# Altium schematic sheet Mux+Conn.SchDoc
size 558 x 431 mm; SheetNumber: 1; SheetTotal: 1; ENG_APP_DATE: --/--/--; DSN_APP_DATE: --/--/--; CHK_APP_DATE: --/--/--
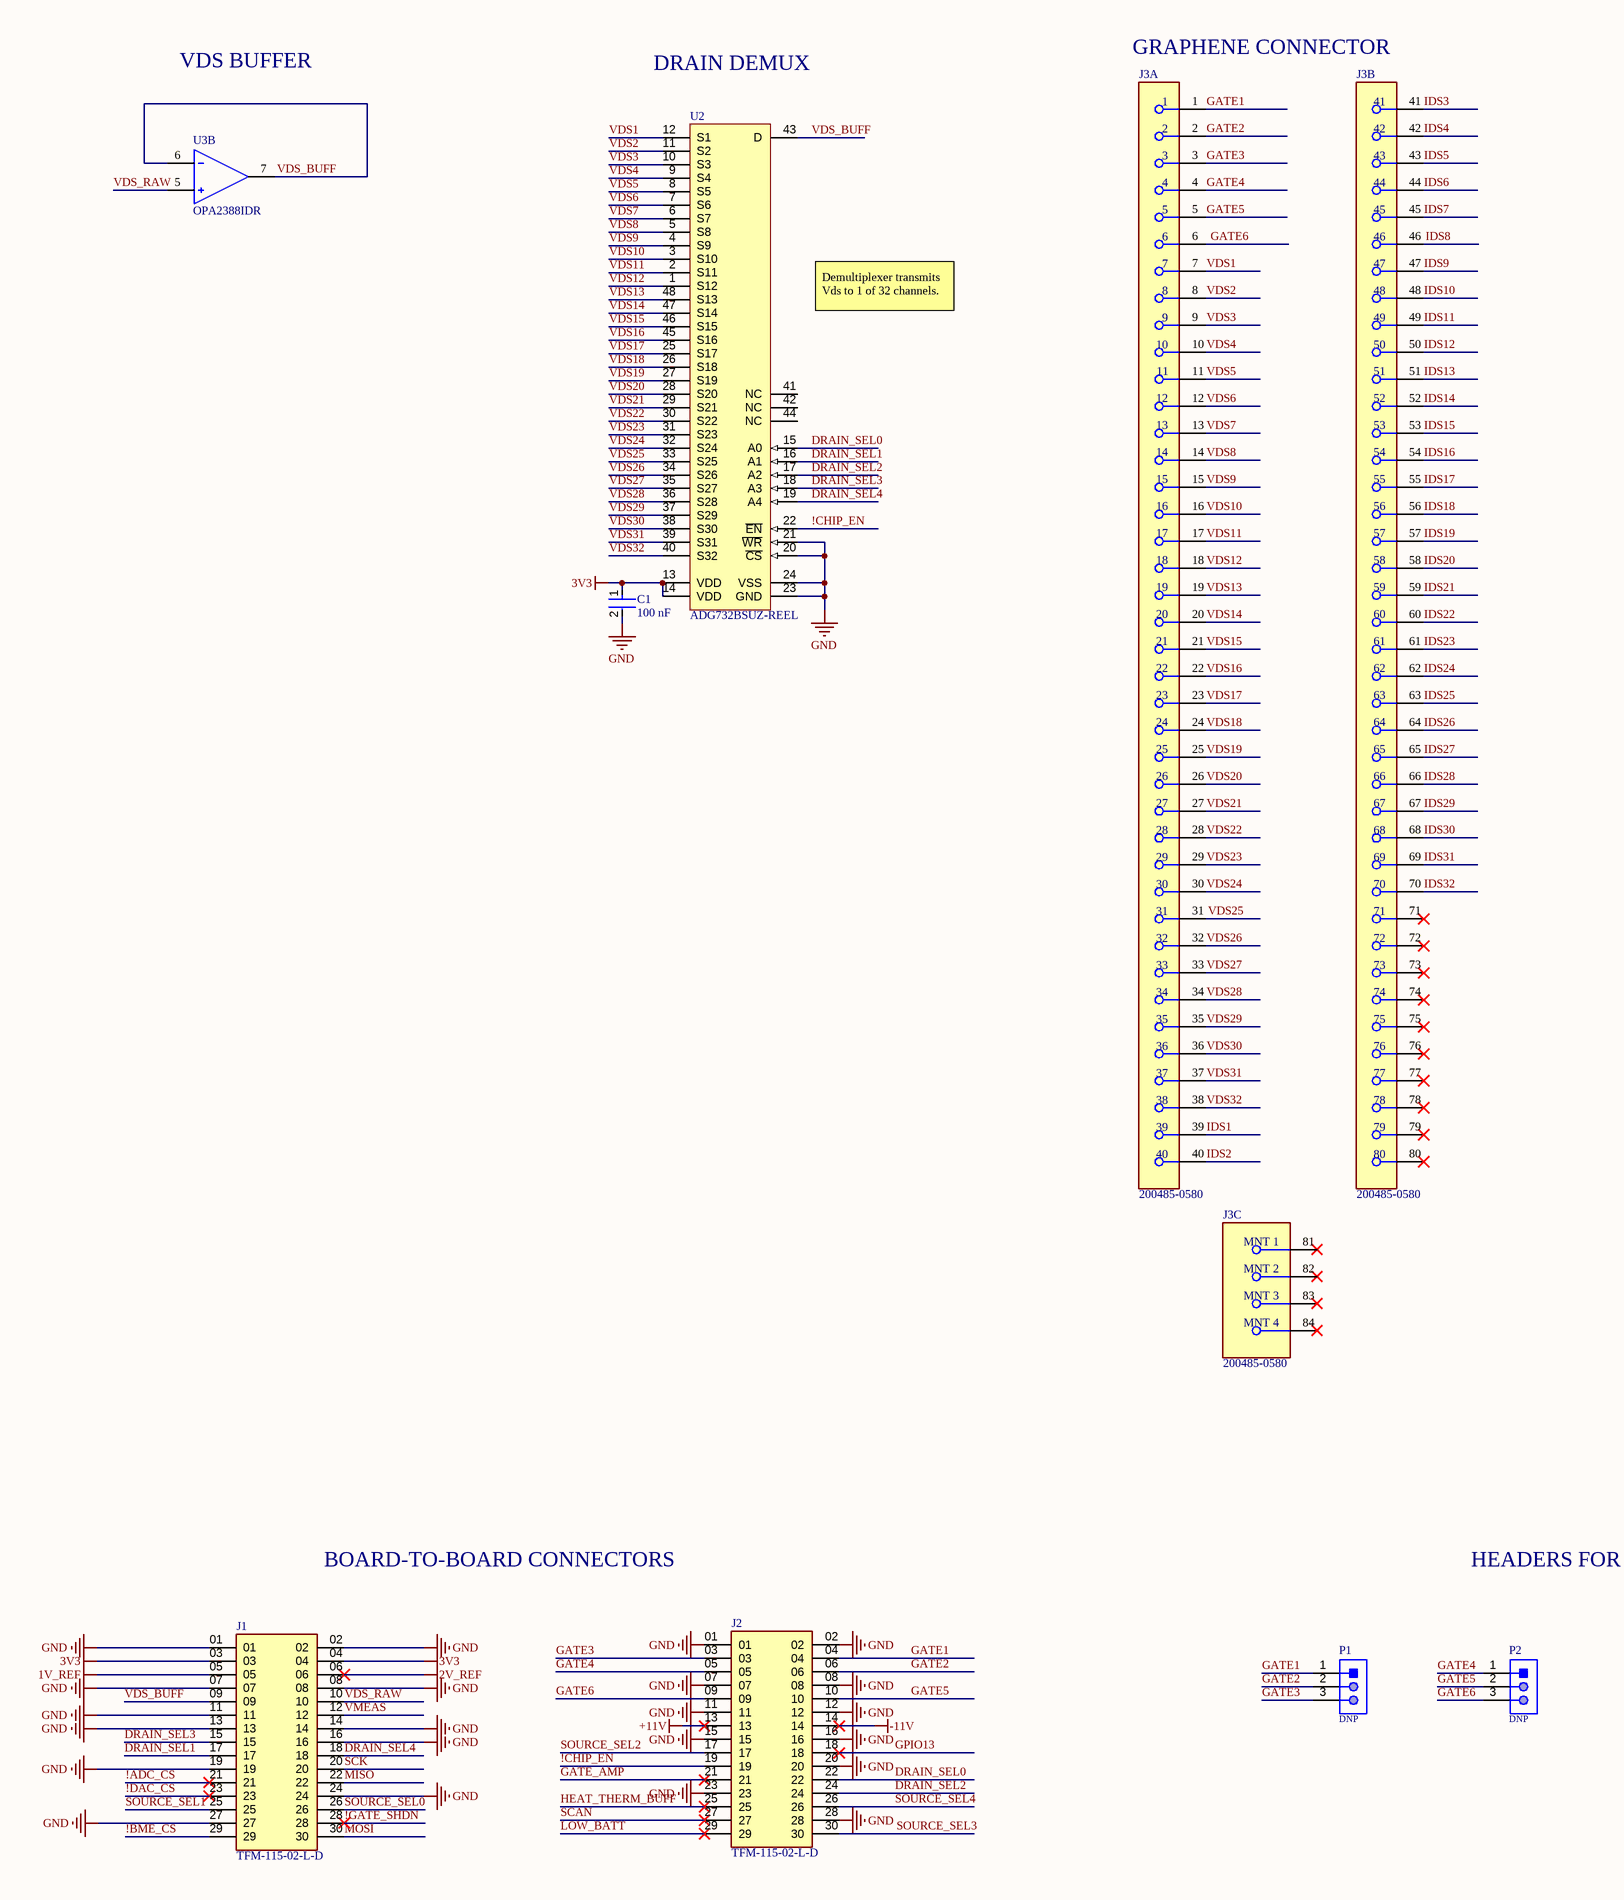
[diagram p0: Mux+Conn.SchDoc, left]
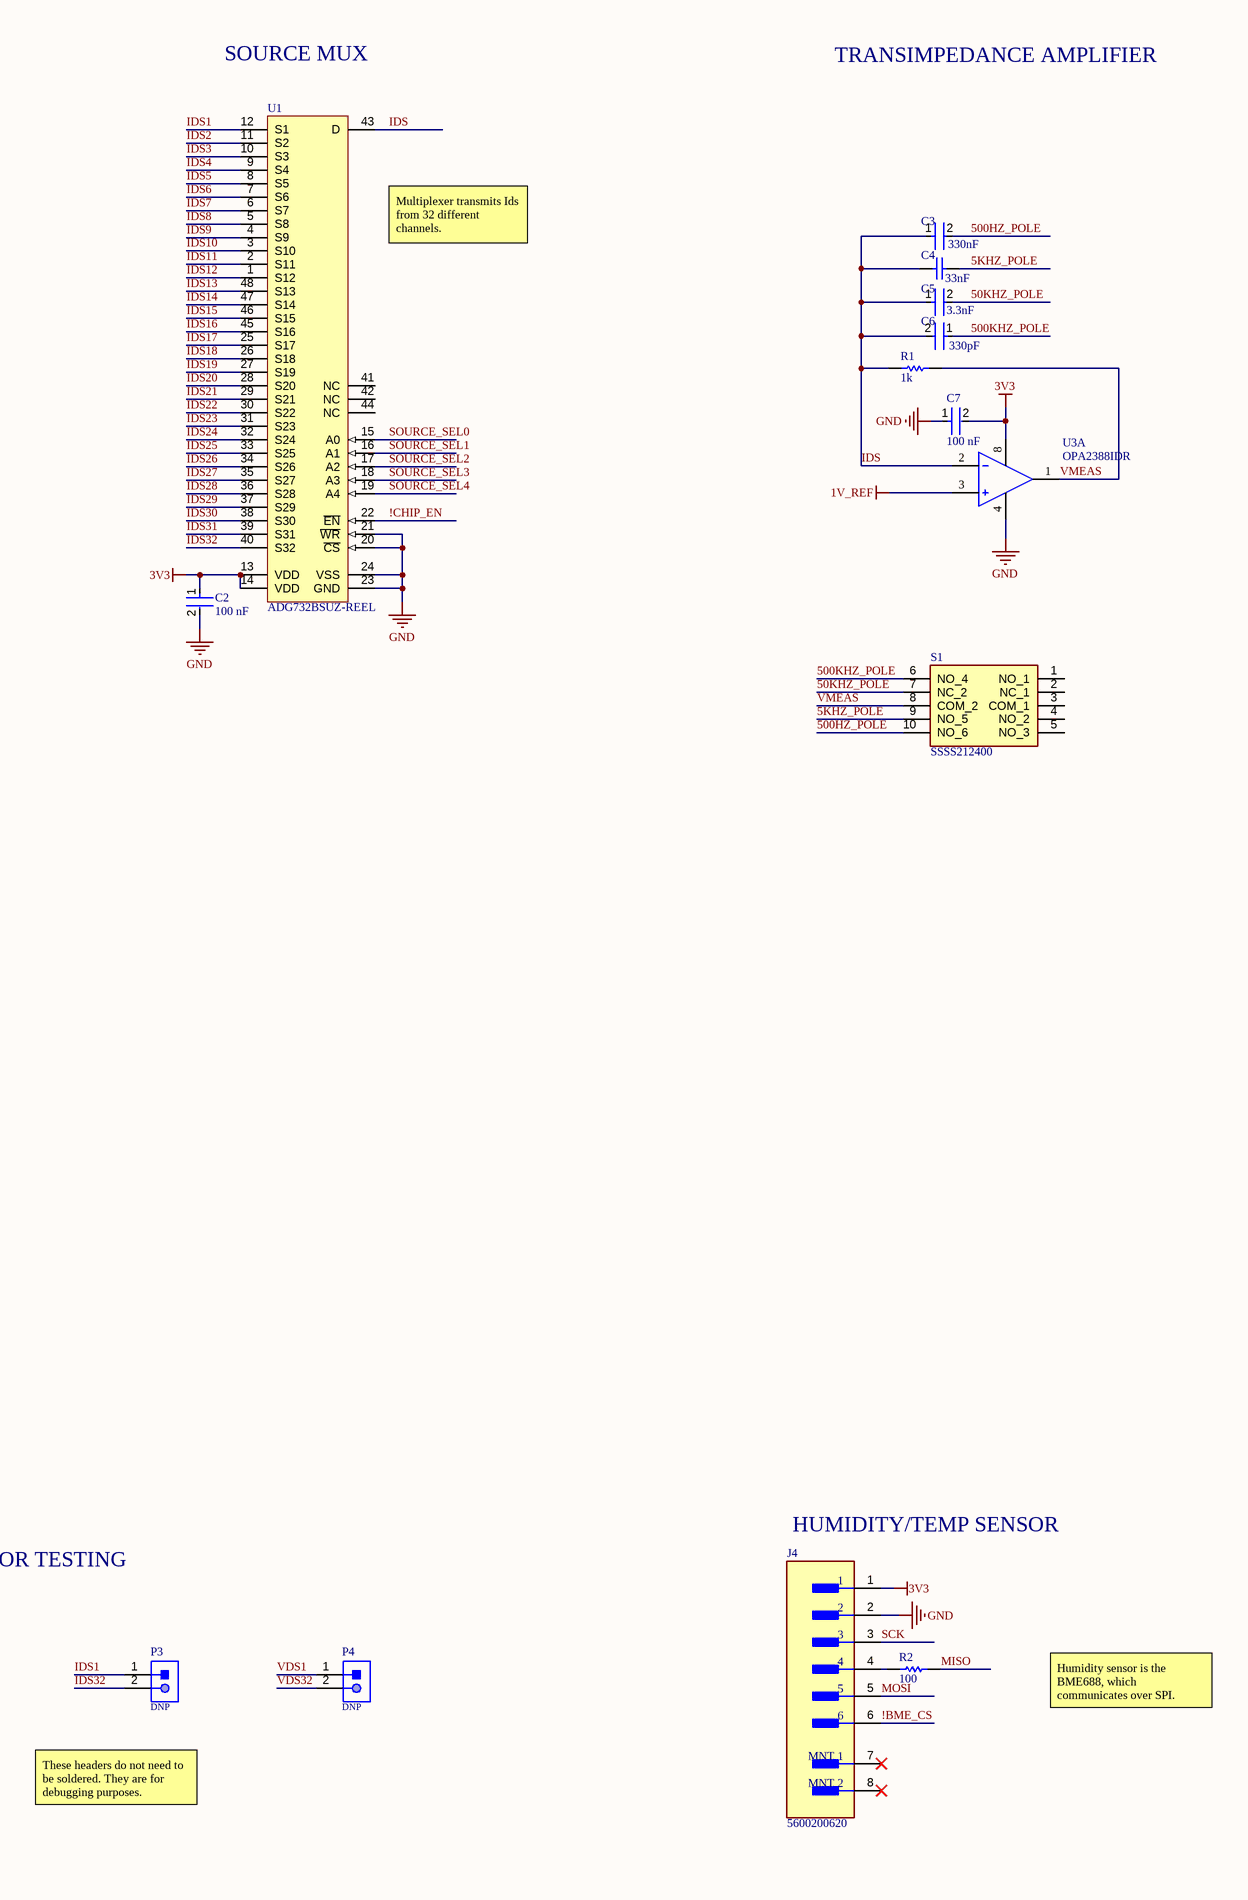
[diagram p1: Mux+Conn.SchDoc, right]

## Parts
C1  100 nF  [FP-C0805C-DN-MFG]
C2  100 nF  [FP-C0805C-DN-MFG]
C3  330nF  [FP-CC0805-0_85-MFG]
C4  33nF  [CAPC2013X95X45NL10T25]
C5  3.3nF  [FP-C0805C-DN-MFG]
C6  330pF  [FP-C0805C-DN-MFG]
C7  100 nF  [FP-C0805C-DN-MFG]
J1  TFM-115-02-L-D  [SAMTEC_TFM-115-02-L-D]
J2  TFM-115-02-L-D  [SAMTEC_TFM-115-02-L-D]
J3  200485-0580  [FP-200485-0580-MFG]  (parts A,B,C of 3)
J4  5600200620  [FP-5600200620-MFG]
P1  DNP  [61300311021]
P2  DNP  [61300311021]
P3  DNP  [61300211021]
P4  DNP  [61300211021]
R1  1k  [RESC2013X55X40LL15T20]
R2  100  [RESC2013X50X30LL20T20]
S1  SSSS212400  [SSSS212400]
U1  ADG732BSUZ-REEL  [ADI-SU-48_N]
U2  ADG732BSUZ-REEL  [ADI-SU-48_N]
U3  OPA2388IDR  [FP-D0008A-IPC_B]  (parts A,B of 2)

## Nets
1V_REF: J1.05 U3.3(+IN_A)
2V_REF: J1.06
3V3: C1.1 C2.1 C7.2 J1.03 J1.04 J4.1 U1.13(VDD) U1.14(VDD) U2.13(VDD) U2.14(VDD) U3.8(V+)
+11V: J2.13
-11V: J2.14
GND: C1.2 C2.2 C7.1 J1.01 J1.02 J1.07 J1.08 J1.11 J1.13 J1.14 J1.16 J1.19 J1.24 J1.27 J2.01 J2.02 J2.07 J2.08 J2.11 J2.12 J2.15 J2.16 J2.20 J2.23 J2.28 J4.2 U1.20(~{CS}) U1.21(~{WR}) U1.23(GND) U1.24(VSS) U2.20(~{CS}) U2.21(~{WR}) U2.23(GND) U2.24(VSS) U3.4(V-)
5KHZ_POLE: C4.2 S1.9(NO_5)
50KHZ_POLE: C5.2 S1.7(NC_2)
500HZ_POLE: C3.2 S1.10(NO_6)
500KHZ_POLE: C6.1 S1.6(NO_4)
!ADC_CS: J1.21
!BME_CS: J1.29 J4.6
!CHIP_EN: J2.19 U1.22(~{EN}) U2.22(~{EN})
!DAC_CS: J1.23
!GATE_SHDN: J1.28
DRAIN_SEL0: J2.22 U2.15(A0)
DRAIN_SEL1: J1.17 U2.16(A1)
DRAIN_SEL2: J2.24 U2.17(A2)
DRAIN_SEL3: J1.15 U2.18(A3)
DRAIN_SEL4: J1.18 U2.19(A4)
GATE1: J2.04 J3.1 P1.1
GATE2: J2.06 J3.2 P1.2
GATE3: J2.03 J3.3 P1.3
GATE4: J2.05 J3.4 P2.1
GATE5: J2.10 J3.5 P2.2
GATE6: J2.09 J3.6 P2.3
GATE_AMP: J2.21
GPIO13: J2.18
HEAT_THERM_BUFF: J2.25
IDS: C3.1 C4.1 C5.1 C6.2 R1.1 U1.43(D) U3.2(-IN_A)
IDS1: J3.39 P3.1 U1.12(S1)
IDS2: J3.40 U1.11(S2)
IDS3: J3.41 U1.10(S3)
IDS4: J3.42 U1.9(S4)
IDS5: J3.43 U1.8(S5)
IDS6: J3.44 U1.7(S6)
IDS7: J3.45 U1.6(S7)
IDS8: J3.46 U1.5(S8)
IDS9: J3.47 U1.4(S9)
IDS10: J3.48 U1.3(S10)
IDS11: J3.49 U1.2(S11)
IDS12: J3.50 U1.1(S12)
IDS13: J3.51 U1.48(S13)
IDS14: J3.52 U1.47(S14)
IDS15: J3.53 U1.46(S15)
IDS16: J3.54 U1.45(S16)
IDS17: J3.55 U1.25(S17)
IDS18: J3.56 U1.26(S18)
IDS19: J3.57 U1.27(S19)
IDS20: J3.58 U1.28(S20)
IDS21: J3.59 U1.29(S21)
IDS22: J3.60 U1.30(S22)
IDS23: J3.61 U1.31(S23)
IDS24: J3.62 U1.32(S24)
IDS25: J3.63 U1.33(S25)
IDS26: J3.64 U1.34(S26)
IDS27: J3.65 U1.35(S27)
IDS28: J3.66 U1.36(S28)
IDS29: J3.67 U1.37(S29)
IDS30: J3.68 U1.38(S30)
IDS31: J3.69 U1.39(S31)
IDS32: J3.70 P3.2 U1.40(S32)
LOW_BATT: J2.29
MISO: J1.22 R2.2
MOSI: J1.30 J4.5
SCAN: J2.27
SCK: J1.20 J4.3
SOURCE_SEL0: J1.26 U1.15(A0)
SOURCE_SEL1: J1.25 U1.16(A1)
SOURCE_SEL2: J2.17 U1.17(A2)
SOURCE_SEL3: J2.30 U1.18(A3)
SOURCE_SEL4: J2.26 U1.19(A4)
VDS1: J3.7 P4.1 U2.12(S1)
VDS2: J3.8 U2.11(S2)
VDS3: J3.9 U2.10(S3)
VDS4: J3.10 U2.9(S4)
VDS5: J3.11 U2.8(S5)
VDS6: J3.12 U2.7(S6)
VDS7: J3.13 U2.6(S7)
VDS8: J3.14 U2.5(S8)
VDS9: J3.15 U2.4(S9)
VDS10: J3.16 U2.3(S10)
VDS11: J3.17 U2.2(S11)
VDS12: J3.18 U2.1(S12)
VDS13: J3.19 U2.48(S13)
VDS14: J3.20 U2.47(S14)
VDS15: J3.21 U2.46(S15)
VDS16: J3.22 U2.45(S16)
VDS17: J3.23 U2.25(S17)
VDS18: J3.24 U2.26(S18)
VDS19: J3.25 U2.27(S19)
VDS20: J3.26 U2.28(S20)
VDS21: J3.27 U2.29(S21)
VDS22: J3.28 U2.30(S22)
VDS23: J3.29 U2.31(S23)
VDS24: J3.30 U2.32(S24)
VDS25: J3.31 U2.33(S25)
VDS26: J3.32 U2.34(S26)
VDS27: J3.33 U2.35(S27)
VDS28: J3.34 U2.36(S28)
VDS29: J3.35 U2.37(S29)
VDS30: J3.36 U2.38(S30)
VDS31: J3.37 U2.39(S31)
VDS32: J3.38 P4.2 U2.40(S32)
VDS_BUFF: J1.09 U2.43(D) U3.6(-IN_B) U3.7(OUT_B)
VDS_RAW: J1.10 U3.5(+IN_B)
VMEAS: J1.12 R1.2 S1.8(COM_2) U3.1(OUT_A)
NetJ4_4: J4.4 R2.1

Not connected (* = marked no-connect by the designer): J3 71* 72* 73* 74* 75* 76* 77* 78* 79* 80* 81(MNT_1)* 82(MNT_2)* 83(MNT_3)* 84(MNT_4)*; J4 7(MNT_1)* 8(MNT_2)*; S1 1(NO_1) 2(NC_1) 3(COM_1) 4(NO_2) 5(NO_3); U1 41(NC) 42(NC) 44(NC); U2 41(NC) 42(NC) 44(NC)

## Notes on the sheet
- VDS BUFFER
- DRAIN DEMUX
- (near J3) GRAPHENE CONNECTOR
- SOURCE MUX
- TRANSIMPEDANCE AMPLIFIER
- (near U1) Multiplexer transmits Ids from 32 different channels.
- (near U2) Demultiplexer transmits Vds to 1 of 32 channels.
- (near J4) HUMIDITY/TEMP SENSOR
- BOARD-TO-BOARD CONNECTORS
- HEADERS FOR TESTING
- Humidity sensor is the BME688, which communicates over SPI.
- These headers do not need to be soldered. They are for debugging purposes.
- DWG. NO.
- REV.
- SHT.
- REVISION
- DESCRIPTION
- DATE
- APPROVED
- THIS DOCUMENT AND THE DATA DISCLOSED HEREIN OR HEREWITH IS THE PROPERTY OF ALTIUM LIMITED AND MAY BE FREELY DISTRIBUTED IN WHOLE. NO RIGHTS ARE RESERVED OR EXPRESS OR IMPLIED WARANTEE GIVEN.
- ENG:
- DSN:
- APPROVALS
- PROJECT
- DOCUMENT REVISION:
- DESIGN ITEM:
- CHK:
- BOM:
- REFERENCE DOCUMENTS
- PROJECT REVISION:
- TITLE
- FAB DWG:
- PCB DWG:
- ASSY DWG:
- SCALE:
- SIZE
- C
- CAGE CODE
- FILE NAME
- DWG NO.
- SHEET
- OF
- REV

## Library data of the parts
C1 C2 C7 = CMP-2007-00279-2: CAP CER 0.1UF 50V X7R 0805; Manufacturer Part Number: C0805C104K5RACTU; Manufacturer: KEMET; Value: 0.10 μF; Tolerance: 0.1; Temperature Coefficient: 30ppm/°C; Material: Ceramic; Device Class L2: Capacitors; Temperature Range Low: -55°C; Voltage Rating: 50 V; Digikey Description: CAP CER 0.1UF 50V X7R 0805; Category: Cap; ComponentLink2Description: Datasheet; Octopart: https://octopart.com/c0805c104k5ractu-kemet-143926; RoHS: TRUE; ComponentLink2URL: https://content.kemet.com/datasheets/KEM_C1003_C0G_SMD.pdf; Temperature Characteristic: X7R; Temperature: -55°C to +125°C; Height: 0.88mm; Temperature Range High: +125°C; Device Class L1: Passive Components; Automotive: No; Lead Free: Yes; Ipc Land Pattern Name: CAPC200125X78; Device Class L3: Ceramic Capacitors; Mouser Description: Cap Ceramic 0.1uF 50V X7R 10% SMD 2.0 x 1.2 mm 125 C Paper T/R; Capacitance: 0.10 μF; Package: C0805C-DN
C3 = CMP-03422-000882-1: Surface Mount Ceramic Multilayer Capacitor 0.33uF 10% X7R 16V 0805 Blister T/R; Manufacturer Part Number: CC0805KKX7R7BB334; Manufacturer: Yageo; Tolerance: 0.1; Height: 0.95mm; Automotive: No; Footprint Url: http://www.yageo.com/exep/pages/download/literatures/UPY-C_GEN_24.pdf; Temperature Characteristic: X7R; Device Class L3: Ceramic Capacitors; Category: Cap; Temperature Range High: +85°C; Temperature Range Low: -30°C; ComponentLink2URL: http://www.yageo.com/documents/recent/UPY-GPHC_Y5V_6.3V-to-50V_8.pdf; Lead Free: Yes; Device Class L2: Capacitors; Package: CC0805-0.85; Material: Ceramic; Voltage Rating: 16 V; Device Class L1: Passive Components; Ipc Land Pattern Name: CAPC200125X85; Mouser Description: Multilayer Ceramic Capacitors MLCC - SMD/SMT 330nF 16V X7R 10%; Octopart: https://octopart.com/cc0805kkx7r7bb334-yageo-42334127; Capacitance: 330 nF; Value: 330 nF; Temperature: -30°C to +85°C; ComponentLink2Description: Datasheet; Digikey Description: Surface Mount Ceramic Multilayer Capacitor 0.33uF 10% X7R 16V 0805 Blister T/R; RoHS: TRUE
C4 = CMP-1036-04169-2: Manufacturer: Murata; Part Number: GRM219R71H333KA01D
C5 = CMP-2007-00373-2: CAP CER 3300PF 50V X7R 0805; Manufacturer: KEMET; Manufacturer Part Number: C0805C332K5RACTU; Capacitance: 3,300 pF; Tolerance: 0.1; Material: Ceramic; Temperature Coefficient: 30ppm/°C; Value: 3,300 pF; Temperature Range High: +125°C; Octopart: https://octopart.com/c0805c332k5ractu-kemet-90782; ComponentLink2Description: Datasheet; Voltage Rating: 50 V; Automotive: No; Temperature: -55°C to +125°C; Temperature Range Low: -55°C; Device Class L2: Capacitors; Mouser Description: Multilayer Ceramic Capacitors MLCC - SMD/SMT 50volts 3300pF X7R 10%; Digikey Description: CAP CER 3300PF 50V X7R 0805; Temperature Characteristic: X7R; Package: C0805C-DN; RoHS: TRUE; Category: Cap; Ipc Land Pattern Name: CAPC200125X78; ComponentLink2URL: https://content.kemet.com/datasheets/KEM_C1003_C0G_SMD.pdf; Lead Free: Yes; Device Class L3: Ceramic Capacitors; Height: 0.88mm; Device Class L1: Passive Components
C6 = CMP-2007-00598-2: CAP CER 330PF 50V C0G/NP0 0805; Manufacturer: KEMET; Manufacturer Part Number: C0805C331J5GACTU; Temperature Coefficient: 30ppm/°C; Tolerance: 0.05; Temperature Characteristic: C0G; Material: Ceramic; Package: C0805C-DN; Temperature Range High: +125°C; Temperature: -55°C to +125°C; Mouser Description: Ceramic Capacitor 330Pf 50V, C0G, 5%, 0805, Full Reel; Category: Cap; Automotive: No; Ipc Land Pattern Name: CAPC200125X78; Device Class L1: Passive Components; ComponentLink2URL: https://content.kemet.com/datasheets/KEM_C1003_C0G_SMD.pdf; Digikey Description: CAP CER 330PF 50V C0G/NP0 0805; Lead Free: Yes; Device Class L2: Capacitors; Temperature Range Low: -55°C; Capacitance: 330 pF; Height: 0.88mm; Value: 330 pF; Octopart: https://octopart.com/c0805c331j5gactu-kemet-85885; Voltage Rating: 50 V; RoHS: TRUE; ComponentLink2Description: Datasheet; Device Class L3: Ceramic Capacitors
J1 J2 = TFM-115-02-L-D: MF: Samtec Inc.; System: Connector; Availability: Unavailable; Price: None; Package: None; MP: TFM-115-02-L-D; Parameter 1: *; Parameter 2: *
J3 = CMP-04775-000018-1: 0.5 ONE-TOUCH ST 80P; System: Connector
J4 = CMP-04776-000066-1: CONN HEADER SMD 6POS 2MM; Manufacturer: Molex; Conn Gender: Male; Conn Orientation: Vertical; Current Rating: 3A; Number Of Contacts: 6; Voltage Rating: 125V; Lead Free: Yes; Device Class L2: Headers and Wire Housings; Footprint Url: https://www.molex.com/pdm_docs/sd/5600200320_sd.pdf; Octopart: https://octopart.com/5600200620-molex-51767481; RoHS: TRUE; Pitch: 2mm; ComponentLink2Description: Datasheet; Device Class L3: unset; Digikey Description: CONN HEADER SMD 6POS 2MM; Automotive: No; Temperature: -40°C to +125°C; Contact Material: Tin,Nickel; ComponentLink2URL: https://www.molex.com/webdocs/datasheets/pdf/en-us/5600200320_PCB_HEADERS.pdf; Package: 5600200620; Height: 8.2mm; Temperature Range High: +125°C; Number Of Rows: 1; Category: Conn; Temperature Range Low: -40°C; Manufacturer Part Number: 5600200620; Device Class L1: Connectors
P1 P2 = CMP-1502-01061-1: THT Angled Pin Header WR-PHD, Pitch 2.54 mm, Single Row, 3 pins; Manufacturer: Wurth Elektronik; Pitch: 2.54mm; Contact Resistance: 20mOhm; Gender: Male; Pin Number: 3; Rated Current: 3A; Working Voltage: 250VAC; Withstanding Voltage: 500VAC; Package Reference: 61300311021; Manufacturer URL: http://www.we-online.de; Datasheet URL: https://katalog.we-online.de/em/datasheet/6130xx11021.pdf; Row Number: Single; Operating Temperature: -40to105degC; Publisher: WurthElektronik; Orientation: Angled; Mounting Technology: THT; Part Number: 61300311021; Packaging: Bag
P3 P4 = CMP-1502-01059-1: THT Angled Pin Header WR-PHD, Pitch 2.54 mm, Single Row, 2 pins; Manufacturer: Wurth Elektronik; Withstanding Voltage: 500VAC; Gender: Male; Pitch: 2.54mm; Pin Number: 2; Rated Current: 3A; Contact Resistance: 20mOhm; Working Voltage: 250VAC; Mounting Technology: THT; Part Number: 61300211021; Manufacturer URL: http://www.we-online.de; Operating Temperature: -40to105degC; Row Number: Single; Publisher: WurthElektronik; Orientation: Angled; Datasheet URL: https://katalog.we-online.de/em/datasheet/6130xx11021.pdf; Packaging: Bag; Package Reference: 61300211021
R1 = CMP-2001-04738-1: TNPW08051K00BEEN; Manufacturer: Vishay Dale; Part Number: TNPW08051K00BEEN
R2 = CMP-2001-04901-1: Manufacturer: Vishay Dale; Part Number: CRCW0805100RFKEA
S1 = SSSS212400: Switch; Manufacturer_Name: ALPS Electric; Datasheet Link: https://www.alps.com/prod/info/E/HTML/Switch/Slide/SSSS2/SSSS224100.html; Height: 3.5mm; Manufacturer_Part_Number: SSSS212400; Mouser Part Number: 688-SSSS212400; Mouser Price/Stock: https://www.mouser.com/Search/Refine.aspx?Keyword=688-SSSS212400
U1 U2 = CMP-0798-00236-1: 1.8 to 5.5 V / +/-2.5 V, 4 Ohm, 32-Channel Analog Multiplexer, -40 to 85 degC, 48-pin QFP (SU-48), Reel; Manufacturer: Analog Devices; Ron (ohms): 4; Max Analog Signal Range: Vss to Vdd; Bandwidth (Hz): 18M; Supply V Guar Performance: Dual_(+/-2.5V), Single_(+3V), Single_(+5V); t transition (s): 23n; PackageReference: SU-48; ComponentLink3URL: http://www.analog.com/static/imported-files/packages/470644706845302410119987SU48_7x7.pdf; PartNumber: ADG732BSUZ-REEL; ComponentLink1URL: http://www.analog.com/en/index.html; Mounting Technology: Surface Mount; ComponentLink2Description: Datasheet; Packing: Reel; ComponentLink1Description: Manufacturer URL; DatasheetVersion: Rev. 0; ComponentLink2URL: http://www.analog.com/static/imported-files/data_sheets/ADG726_732.pdf; PackageDescription: 48-Pin Thin Plastic Quad Flat Package, Body 7 x 7 mm, Pitch 0.5 mm; Code_JEDEC: MS-026ABC; ComponentLink3Description: Package Specification
U3 = CMP-04895-000483-1: IC OPAMP ZER-DRIFT 2CIRC 8SOIC; Number of Channels: 2; Max Operating Temperature: 125°C; RoHS Compliant: Yes; Min Operating Temperature: -40°C